# EAGLE design LOCO-Univ-Control-Adapter (EAGLE 9.7.0)

## Sheet 1 of 2
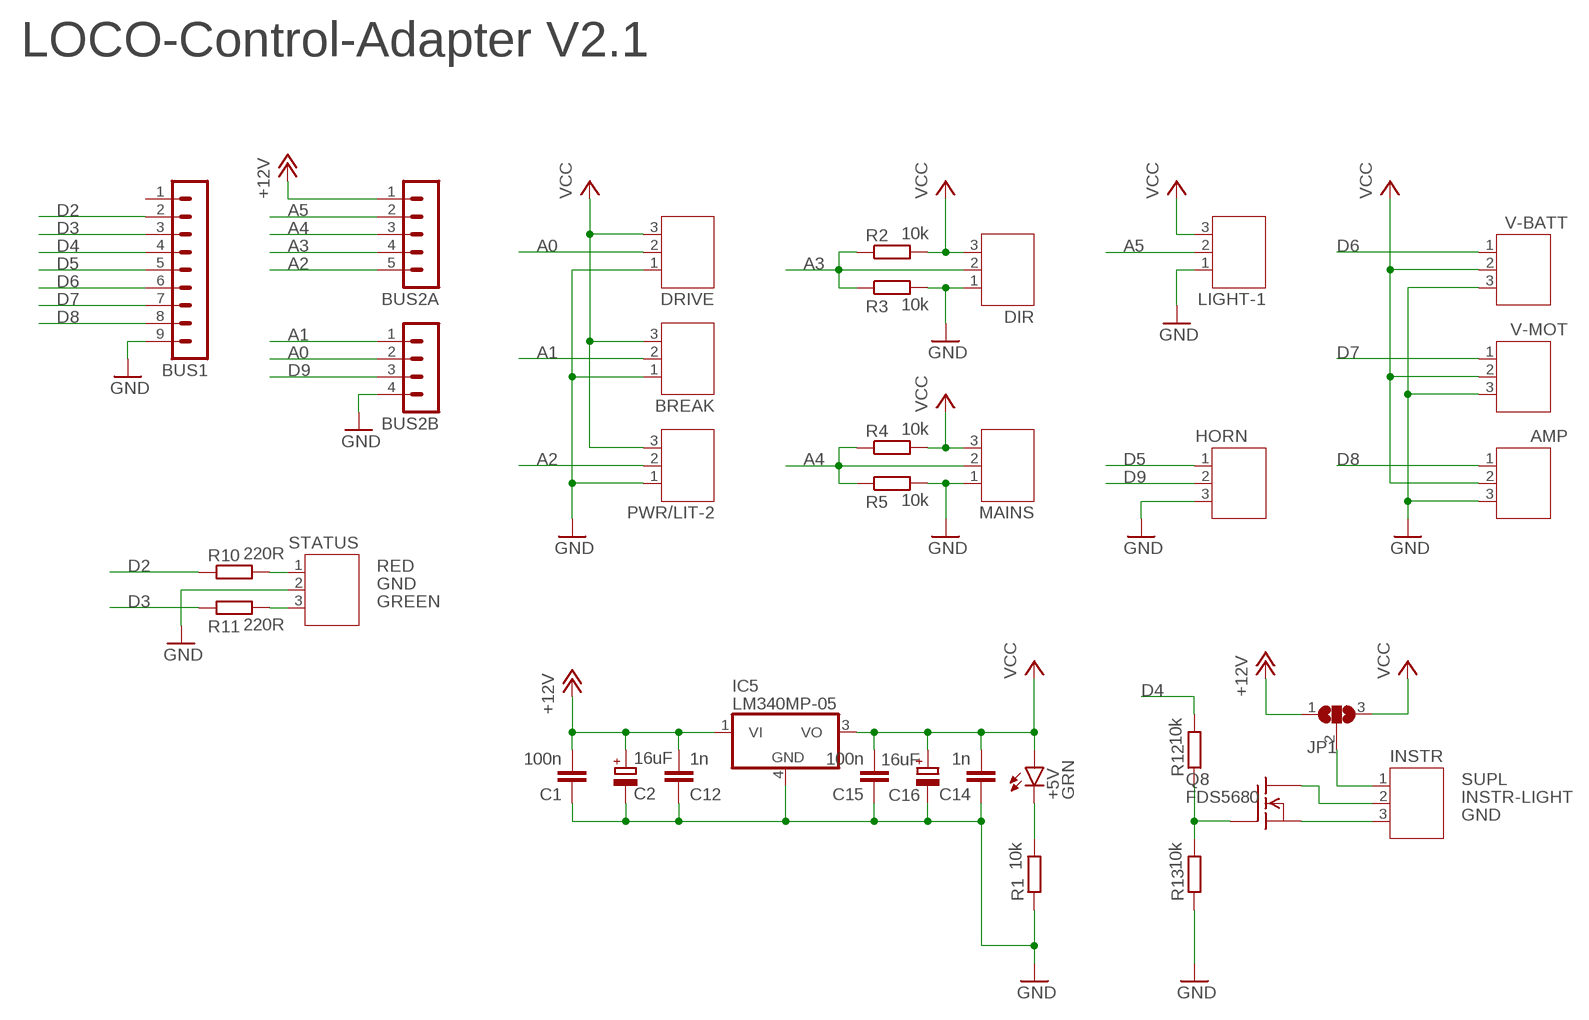
[diagram p0: schematic, sheet 1]

### Parts
+5V  GRN  LEDCHIP-LED0603  [CHIP-LED0603]
AMP  JST-PH3  [JST-PH3]
BREAK  JST-PH3  [JST-PH3]
BUS1  MA09-1  [MA09-1]
BUS2A  MA05-1  [MA05-1]
BUS2B  MA04-1  [MA04-1]
C1  100n  C-EUC0402K  [C0402K]
C2  16uF  CPOL-EUA/3216-18W  [A/3216-18W]
C12  1n  C-EUC0402K  [C0402K]
C14  1n  C-EUC0402K  [C0402K]
C15  100n  C-EUC0402K  [C0402K]
C16  16uF  CPOL-EUA/3216-18W  [A/3216-18W]
DIR  JST-PH3  [JST-PH3]
DRIVE  JST-PH3  [JST-PH3]
HORN  JST-PH3  [JST-PH3]
IC5  LM340MP-05  [SOT223]
INSTR  JST-PH3  [JST-PH3]
JP1  SJ2W  [SJ_2]
LIGHT-1  JST-PH3  [JST-PH3]
MAINS  JST-PH3  [JST-PH3]
PWR/LIT-2  JST-PH3  [JST-PH3]
Q8  FDS5680  [SO-8]
R1  10k  R-EU_R0603  [R0603]
R2  10k  R-EU_R0805  [R0805]
R3  10k  R-EU_R0805  [R0805]
R4  10k  R-EU_R0805  [R0805]
R5  10k  R-EU_R0805  [R0805]
R10  220R  R-EU_R0805  [R0805]
R11  220R  R-EU_R0805  [R0805]
R12  10k  R-EU_R0603  [R0603]
R13  10k  R-EU_R0603  [R0603]
STATUS  JST-PH3  [JST-PH3]
V-BATT  JST-PH3  [JST-PH3]
V-MOT  JST-PH3  [JST-PH3]

### Nets
+12V: BUS2A.1 C1.2 C2.+ C12.2 IC5.1(VI) JP1.1
A0: BUS2B.2 DRIVE.2
A1: BREAK.2 BUS2B.1
A2: BUS2A.5 PWR/LIT-2.2
A3: BUS2A.4 DIR.2 R2.1 R3.1
A4: BUS2A.3 MAINS.2 R4.1 R5.1
A5: BUS2A.2 LIGHT-1.2
D2: BUS1.2 R10.1
D3: BUS1.3 R11.1
D4: BUS1.4 R12.2
D5: BUS1.5 HORN.1
D6: BUS1.6 V-BATT.1
D7: BUS1.7 V-MOT.1
D8: AMP.1 BUS1.8
D9: BUS2B.3 HORN.2
GND: AMP.3 BREAK.1 BUS1.9 BUS2B.4 C1.1 C2.- C12.1 C14.1 C15.1 C16.- DIR.1 DRIVE.1 HORN.3 IC5.4(GND) INSTR.3 LIGHT-1.1 MAINS.1 PWR/LIT-2.1 Q8.1(S) Q8.2(S) Q8.3(S) R1.1 R3.2 R5.2 R13.1 STATUS.2 V-BATT.3 V-MOT.3
GREEN: R11.2 STATUS.3
INSTR-LIGHT: INSTR.2 Q8.5(D) Q8.6(D) Q8.7(D) Q8.8(D)
N$8: Q8.4(G) R12.1 R13.2
N$12: +5V.C R1.2
RED: R10.2 STATUS.1
SUPL: INSTR.1 JP1.2
VCC: +5V.A AMP.2 BREAK.3 C14.2 C15.2 C16.+ DIR.3 DRIVE.3 IC5.3(VO) JP1.3 LIGHT-1.3 MAINS.3 PWR/LIT-2.3 R2.2 R4.2 V-BATT.2 V-MOT.2
Unconnected: BUS1.1

### Notes on the sheet
- LOCO-Control-Adapter V2.1

## Sheet 2 of 2

## Library data of the parts
+5V = led:LED: LED OSRAM: - CHIPLED LG R971, LG N971, LY N971, LG Q971, LY Q971, LO R971, LY R971 LH N974, LH R974 LS Q976, LO Q976, LY Q976 LO Q996 - Hyper CHIPLED LW Q18S LB Q993, LB Q99A, LB R99A - SideLED LS A670, LO A670, LY A670, LG A670, LP A670 LB A673, LV A673, LT A673, LW A673 LH A674 LY A675 LS A676, LA A676, LO A676, LY A676, LW A676 LS A679, LY A679, LG A679 - Hyper Micro SIDELED® LS Y876, LA Y876, LO Y876, LY Y876 LT Y87S - SmartLED LW L88C, LW L88S LB L89C, LB L89S, LG L890 LS L89K, LO L89K, LY L89K LS L896, LA L896, LO L896, LY L896 - TOPLED LS T670, LO T670, LY T670, LG T670, LP T670 LSG T670, LSP T670, LSY T670, LOP T670, LYG T670 LG T671, LOG T671, LSG T671 LB T673, LV T673, LT T673, LW T673 LH T674 LS T676, LA T676, LO T676, LY T676, LB T676, LH T676, LSB T676, LW T676 LB T67C, LV T67C, LT T67C, LS T67K, LO T67K, LY T67K, LW E67C LS E67B, LA E67B, LO E67B, LY E67B, LB E67C, LV E67C, LT E67C LW T67C LS T679, LY T679, LG T679 LS T770, LO T770, LY T770, LG T770, LP T770 LB T773, LV T773, LT T773, LW T773 LH T774 LS E675, LA E675, LY E675, LS T675 LS T776, LA T776, LO T776, LY T776, LB T776 LHGB T686 LT T68C, LB T68C - Hyper Mini TOPLED® LB M676 - Mini TOPLED Santana® LG M470 LS M47K, LO M47K, LY M47K Source: http://www.osram.convergy.de LUXEON: - LUMILED® LXK2-PW12-R00, LXK2-PW12-S00, LXK2-PW14-U00, LXK2-PW14-V00 LXK2-PM12-R00, LXK2-PM12-S00, LXK2-PM14-U00 LXK2-PE12-Q00, LXK2-PE12-R00, LXK2-PE12-S00, LXK2-PE14-T00, LXK2-PE14-U00 LXK2-PB12-K00, LXK2-PB12-L00, LXK2-PB12-M00, LXK2-PB14-N00, LXK2-PB14-P00, LXK2-PB14-Q00 LXK2-PR12-L00, LXK2-PR12-M00, LXK2-PR14-Q00, LXK2-PR14-R00 LXK2-PD12-Q00, LXK2-PD12-R00, LXK2-PD12-S00 LXK2-PH12-R00, LXK2-PH12-S00 LXK2-PL12-P00, LXK2-PL12-Q00, LXK2-PL12-R00 Source: www.luxeon.com KINGBRIGHT: KA-3528ASYC Source: www.kingbright.com
AMP BREAK DIR DRIVE HORN INSTR LIGHT-1 MAINS PWR/LIT-2 STATUS V-BATT V-MOT = jst-ph:JST-PH3
BUS1 = con-lstb:MA09-1: PIN HEADER; OC_FARNELL: unknown; OC_NEWARK: unknown
BUS2A = con-lstb:MA05-1: PIN HEADER; OC_FARNELL: unknown; OC_NEWARK: unknown
BUS2B = con-lstb:MA04-1: PIN HEADER; OC_FARNELL: unknown; OC_NEWARK: unknown
C1 C12 C14 C15 = rcl:C-EU: CAPACITOR, European symbol; SPICEPREFIX: C
C2 C16 = rcl:CPOL-EU: POLARIZED CAPACITOR, European symbol; SPICEPREFIX: C
IC5 = linear:LM340?-*: Positive VOLTAGE REGULATOR Source: http://cache.national.com/ds/LM/LM340.pdf
JP1 = jumper:SJ2W: SMD solder JUMPER
Q8 = transistor-fet:FDS5680: 60V N-Channel PowerTrench TM MOSFET FAIRCHILD FDS5680.pdf
R1-R5 R10-R13 = rcl:R-EU_: RESISTOR, European symbol; SPICEPREFIX: R

## Board
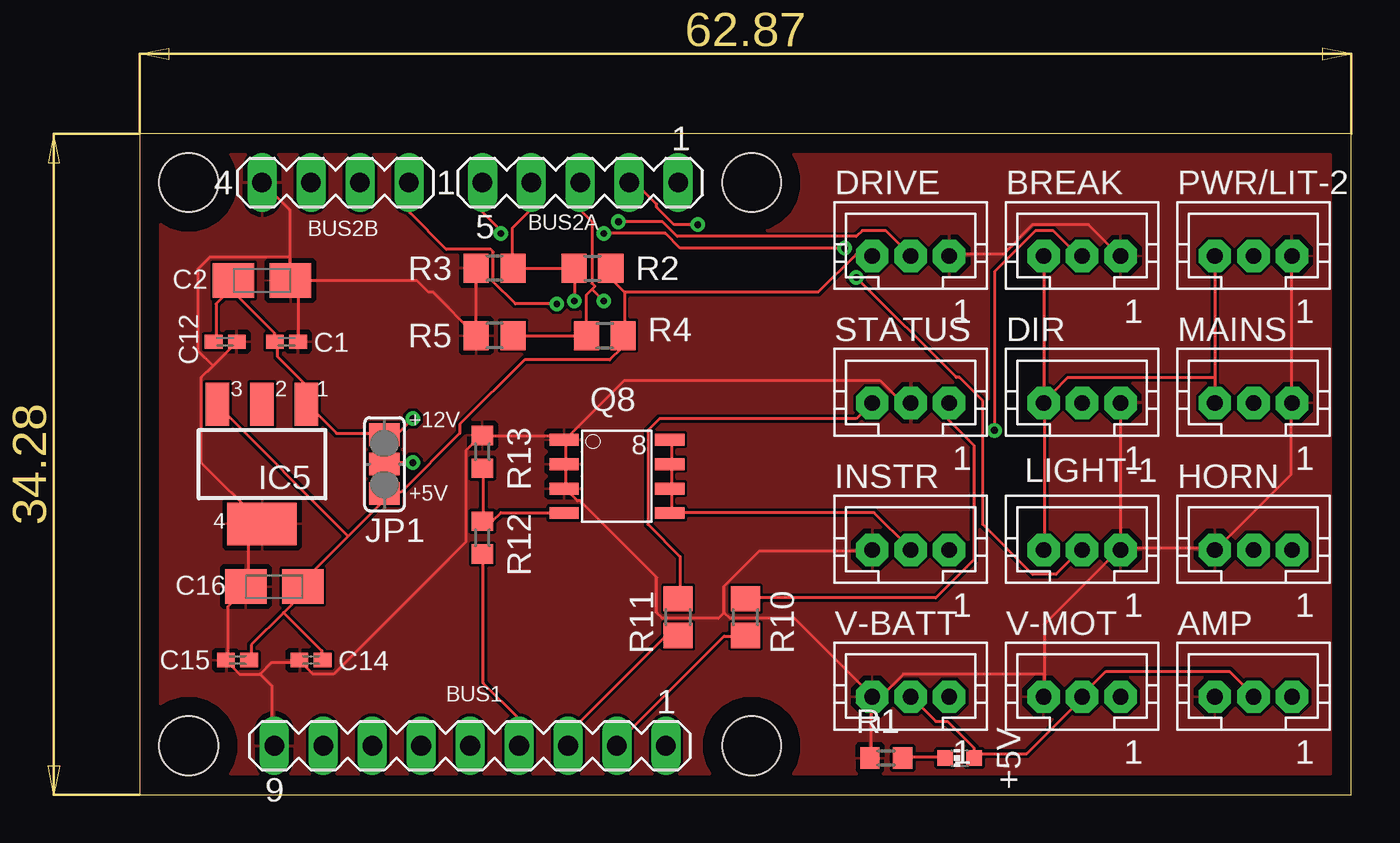
[diagram p1: board, top side]
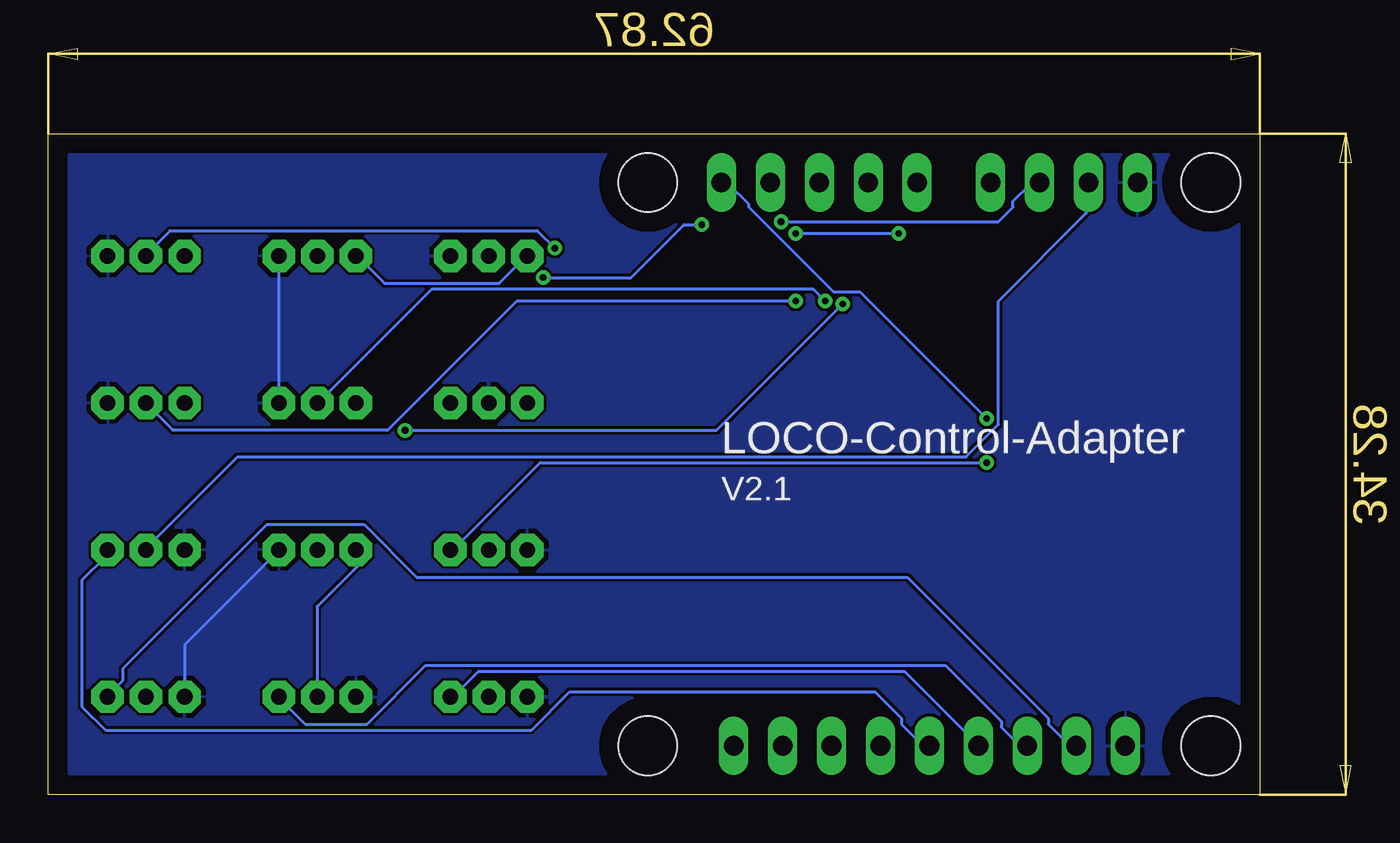
[diagram p2: board, bottom side, seen from below]

Size 62.87 x 34.29 mm. Coordinates in mm from the lower left corner, seen from the top.
Outline: 0,0 62.87,0 62.87,34.29 0,34.29 0,0
Copper layers (1*16): Top / Bottom
Stack-up Default Layer Stack: Top User Defined 0.035mm / Dielectric-1 User Defined 1.5mm / Bottom User Defined 0.035mm
Design rules "default": minimum track width 6mil, minimum drill 0.35mm, track to track 6mil, track to pad 6mil, pad to pad 6mil, via to via 6mil, smd to smd 6mil, copper to edge 40mil, drill to drill 6mil, minimum pad ring 10mil, minimum via ring 8mil, stop-mask expansion 4mil, vias tented up to drill 0mil, thermal gap 10mil
Holes 3.05 mm at 2.54,2.54 2.54,31.75 31.75,2.54 31.75,31.75

### Footprints (pad centres in the part's own frame; a part is rotated, then mirrored left to right if it is on the bottom)
CHIP-LED0603 = smd 0.8 x 0.8: A 0,-0.75; C 0,0.75
JST-PH3 = drill 0.813 pad 1.676 octagon: 1 2,0; 2 0,0; 3 -2,0
MA09-1 = drill 1.016 long: 1 -10.16,0; 2 -7.62,0; 3 -5.08,0; 4 -2.54,0; 5 0,0; 6 2.54,0; 7 5.08,0; 8 7.62,0; 9 10.16,0
MA05-1 = drill 1.016 long: 1 -5.08,0; 2 -2.54,0; 3 0,0; 4 2.54,0; 5 5.08,0
MA04-1 = drill 1.016 long: 1 -3.81,0; 2 -1.27,0; 3 1.27,0; 4 3.81,0
C0402K = smd 0.925 x 0.74: 1 -0.6,0; 2 0.6,0
A/3216-18W = smd 2.15 x 1.8: + 1.475,0; - -1.475,0
SOT223 = smd 1.219 x 2.235: 1 -2.311,-3.099; 2 0,-3.099; 3 2.311,-3.099 | smd 3.6 x 2.2: 4 0,3.099
SJ_2 = smd 1.168 x 1.6: 1 -1.524,0; 2 0,0; 3 1.524,0
SO-8 = smd 1.524 x 0.61: 1 -2.743,1.905; 2 -2.743,0.635; 3 -2.743,-0.635; 4 -2.743,-1.905; 5 2.743,-1.905; 6 2.743,-0.635; 7 2.743,0.635; 8 2.743,1.905
R0603 = smd 1 x 1.1: 1 -0.85,0; 2 0.85,0
R0805 = smd 1.3 x 1.5: 1 -0.95,0; 2 0.95,0

### Placement (x,y rotation side)
+5V  42.55,1.91 90 top
AMP  57.78,5.08 0 top
BREAK  48.9,27.94 0 top
BUS1  17.14,2.54 180 top
BUS2A  22.86,31.75 180 top
BUS2B  10.16,31.75 180 top
C1  7.62,23.5 180 top
C2  6.35,26.67 180 top
C12  4.45,23.5 180 top
C14  8.89,6.99 0 top
C15  5.08,6.99 0 top
C16  6.99,10.79 0 top
DIR  48.9,20.32 0 top
DRIVE  40.01,27.94 0 top
HORN  57.78,12.7 0 top
IC5  6.35,17.14 180 top
INSTR  40.01,12.7 0 top
JP1  12.7,17.14 270 top
LIGHT-1  48.9,12.7 0 top
MAINS  57.78,20.32 0 top
PWR/LIT-2  57.78,27.94 0 top
Q8  24.77,16.51 0 top
R1  38.73,1.91 0 top
R2  23.5,27.3 0 top
R3  18.41,27.3 180 top
R4  24.13,23.81 0 top
R5  18.41,23.81 180 top
R10  31.43,9.21 90 top
R11  27.94,9.21 90 top
R12  17.78,13.34 270 top
R13  17.78,17.78 270 top
STATUS  40.01,20.32 0 top
V-BATT  40.01,5.08 0 top
V-MOT  48.9,5.08 0 top

### Tracks (layer width: path | path; a pad name or v marks a point on that pad's centre or on a via)
+12V  (via drill 0.35)
  Top 0.152: 4.72,26.21 3.96,25.45 3.96,23.62 C12.2 | 4.72,26.21 4.72,26.67 C2.+ 4.72,26.21 | 4.72,26.21 7.01,23.93 7.01,23.62 C1.2 7.16,23.47 7.16,22.71 8.53,21.34 8.53,20.27 IC5.1 8.69,20.27 10.21,18.75 12.65,18.75 JP1.1 12.8,18.75 13.41,18.75 v14.17,19.51
  Bottom 0.152: v14.17,19.51 20.73,26.06 22.1,26.06 26.52,30.48 26.52,30.63 27.58,31.7 27.89,31.7 BUS2A.1
A0  (via drill 0.35)
  Top 0.152: v24.84,29.72 27.13,29.72 27.89,28.96 37.19,28.96 37.49,29.26 38.71,29.26 39.93,28.04 DRIVE.2
  Bottom 0.152: v24.84,29.72 13.56,29.72 12.8,30.48 12.8,30.79 11.89,31.7 11.43,31.7 BUS2B.2
A1  (via drill 0.35)
  Top 0.152: v44.35,18.9 44.35,27.13 46.48,29.26 47.4,29.26 48.77,27.89 BREAK.2 | BUS2B.1 14.02,31.7 14.02,30.18 15.91,28.28 18.21,28.28 18.34,28.15 18.34,26.6 19.5,25.45 v21.64,25.45
  Bottom 0.152: v21.64,25.45 28.19,18.9 v44.35,18.9
A2  (via drill 0.35)
  Top 0.152: v18.75,29.11 18.75,29.26 17.83,30.18 17.83,31.7 BUS2A.5 | v24.08,29.11 27.28,29.11 28.04,28.35 v36.58,28.35
  Bottom 0.152: v24.08,29.11 v18.75,29.11 | v36.58,28.35 37.49,29.26 56.54,29.26 57.76,28.04 PWR/LIT-2.2
A3  (via drill 0.35)
  Top 0.152: BUS2A.4 20.27,31.7 20.27,30.33 19.36,29.41 19.36,27.43 R3.1 19.51,27.28 22.4,27.28 R2.1 22.55,27.28 v22.55,25.6
  Bottom 0.152: v22.55,25.6 23.16,26.21 42.98,26.21 48.77,20.42 DIR.2
A4  (via drill 0.35)
  Top 0.152: R5.1 19.51,23.77 23.16,23.77 R4.1 23.16,23.93 23.16,25.91 23.47,26.21 | 23.47,26.21 23.62,26.36 23.47,26.52 23.47,29.72 22.86,30.33 BUS2A.3 | 23.47,26.21 v24.08,25.6
  Bottom 0.152: v24.08,25.6 38.56,25.6 45.26,18.9 56.39,18.9 57.76,20.27 MAINS.2
A5  (via drill 0.35)
  Top 0.152: v28.96,29.57 27.74,29.57 26.82,30.48 26.82,30.63 25.76,31.7 25.45,31.7 BUS2A.2 | v37.19,26.82 42.37,21.64 42.52,21.64 43.74,20.42 43.74,14.02 46.33,11.43 47.55,11.43 48.77,12.65 LIGHT-1.2
  Bottom 0.152: v28.96,29.57 29.87,29.57 32.61,26.82 v37.19,26.82
D2
  Top 0.152: R10.1 31.39,8.23 30.33,8.23 24.69,2.59 BUS1.2
D3
  Top 0.152: R11.1 27.89,8.23 27.28,8.23 22.25,3.2 22.25,2.59 BUS1.3
D4
  Top 0.152: R12.2 17.83,12.34 17.83,5.79 19.66,3.96 19.66,2.59 BUS1.4
D5
  Bottom 0.152: BUS1.5 17.22,2.59 17.53,2.59 18.59,3.66 18.59,3.96 19.96,5.33 35.81,5.33 37.8,3.35 59.89,3.35 61.11,4.57 61.11,11.12 59.89,12.34 59.89,12.65 HORN.1
D6
  Bottom 0.152: BUS1.6 14.63,2.59 18.44,6.4 40.54,6.4 41.91,5.03 V-BATT.1
D7
  Bottom 0.152: BUS1.7 12.19,2.59 12.5,2.59 13.41,3.5 13.41,3.81 16.31,6.71 43.28,6.71 46.33,3.66 49.53,3.66 50.9,5.03 V-MOT.1
D8
  Bottom 0.152: BUS1.8 9.6,2.59 9.91,2.59 10.97,3.66 10.97,3.96 18.29,11.28 43.74,11.28 46.48,14.02 51.51,14.02 58.98,6.55 58.98,5.94 59.74,5.18 AMP.1
D9
  Bottom 0.152: BUS2B.3 8.99,31.7 8.99,30.18 13.56,25.6 13.56,19.2 15.24,17.53 53.03,17.53 57.76,12.8 HORN.2
GND
  Top 0.152: 8.23,26.67 14.38,26.67 14.99,26.06 15.22,26.06 R5.2 R3.2 | 6.25,6.25 6.86,6.86 8.23,6.86 C14.1 8.38,6.86 8.99,6.25 10.06,6.25 16.92,13.11 16.92,17.83 17.68,18.59 R13.1 17.83,18.59 21.79,18.59 21.95,18.44 Q8.1 | 6.25,6.25 5.18,6.25 4.57,6.86 C15.1 4.57,7.01 4.57,9.75 5.49,10.67 C16.- 5.64,10.82 5.64,13.41 6.25,14.02 IC5.4 6.25,14.17 3.2,17.22 3.2,21.64 3.81,22.25 | 6.25,6.25 6.86,5.64 6.86,2.59 BUS1.9 | 8.23,26.67 8.23,23.62 C1.1 | 8.23,26.67 C2.- 7.77,26.67 7.77,27.89 | 7.77,27.89 7.77,30.33 BUS2B.4 | 3.81,22.25 5.03,23.47 C12.1 | 7.77,27.89 3.66,27.89 3.05,27.28 3.05,23.01 3.81,22.25 | Q8.1 22.1,18.29 22.1,17.22 Q8.2 22.1,17.07 22.1,16 Q8.3 22.1,15.85 22.71,15.24 22.86,15.24 26.82,11.28 26.82,9.45 27.13,9.14 30.02,9.14 30.33,9.45 | STATUS.2 39.93,20.42 39.47,20.42 38.41,21.49 25.15,21.49 22.1,18.44 Q8.1 | DRIVE.1 42.06,28.04 44.81,28.04 46.33,29.57 49.23,29.57 50.75,28.04 BREAK.1 | R1.1 37.95,1.98 37.95,5.03 V-BATT.3 | 30.33,9.45 30.33,10.82 32.16,12.65 37.95,12.65 INSTR.3 | 30.33,9.45 30.63,9.14 33.98,9.14 37.95,5.18 V-BATT.3 | PWR/LIT-2.1 59.74,27.89 59.74,20.42 MAINS.1 59.74,20.27 59.74,16.61 55.93,12.8 HORN.3 55.78,12.8 50.9,12.8 | 46.94,6.25 46.94,8.84 50.75,12.65 LIGHT-1.1 50.9,12.8 | 46.94,6.25 46.94,5.18 V-MOT.3 | 46.94,6.25 39.62,6.25 38.56,5.18 38.1,5.18 V-BATT.3 | 50.9,12.8 50.9,20.27 DIR.1
  Bottom 0.152: DIR.1 50.9,20.42 50.9,27.89 BREAK.1 | AMP.3 55.78,5.18 55.78,7.77 50.9,12.65 LIGHT-1.1
  pour Top: 0,34.29 62.87,34.29 62.87,0 0,0
  pour Bottom: 0,34.29 62.87,34.29 62.87,0 0,0
GREEN
  Top 0.152: R11.2 28.04,10.21 28.04,12.34 26.36,14.02 26.36,18.9 26.98,19.51 37.19,19.51 37.95,20.27 STATUS.3
INSTR-LIGHT
  Top 0.152: 27.58,14.63 27.58,15.85 Q8.6 27.58,16 27.58,17.07 Q8.7 27.58,17.22 27.58,18.29 Q8.8 | 27.58,14.63 38.1,14.63 39.93,12.8 INSTR.2 | 27.58,14.63 Q8.5
N$8
  Top 0.152: R13.2 17.83,16.92 17.83,14.33 R12.1 17.83,14.17 18.29,14.17 18.75,14.63 21.95,14.63 Q8.4
N$12
  Top 0.152: +5V.C 41.76,1.98 39.62,1.98 R1.2
RED
  Top 0.152: R10.2 31.55,10.21 41.3,10.21 43.28,12.19 43.28,18.14 41.91,19.51 41.91,20.27 STATUS.1
SUPL  (via drill 0.35)
  Top 0.152: v14.17,17.22 12.8,17.22 JP1.2
  Bottom 0.152: v14.17,17.22 37.34,17.22 41.91,12.65 INSTR.1
VCC
  Top 0.152: 43.28,2.13 43.28,2.44 41.91,3.81 41.3,3.81 40.08,5.03 V-BATT.2 | 43.28,2.13 43.28,1.98 +5V.A 43.28,2.13 | 43.28,2.13 46.02,2.13 48.46,4.57 48.46,4.72 48.77,5.03 V-MOT.2 48.92,5.18 50.14,6.4 56.54,6.4 57.76,5.18 AMP.2 | 7.47,9.45 8.38,10.36 8.38,10.67 C16.+ 8.53,10.82 8.53,11.12 10.82,13.41 | 7.47,9.45 5.79,7.77 5.79,7.01 C15.2 | 7.47,9.45 9.45,7.47 9.45,7.01 C14.2 | 10.82,13.41 12.65,15.24 12.65,15.54 JP1.3 12.8,15.7 13.56,15.7 16.61,18.75 16.61,19.2 19.96,22.55 24.38,22.55 24.99,23.16 24.99,23.77 R4.2 25.15,23.93 25.15,26.06 | 10.82,13.41 4.12,20.12 IC5.3 | 25.15,26.06 24.54,26.67 24.54,27.28 R2.2 | 25.15,26.06 35.2,26.06 37.19,28.04 37.95,28.04 DRIVE.3 | 55.78,21.64 55.78,27.89 PWR/LIT-2.3 | 55.78,21.64 55.78,20.42 MAINS.3 | LIGHT-1.3 46.94,12.8 46.94,20.27 DIR.3 | 46.94,20.88 46.94,20.42 DIR.3 | 46.94,20.88 46.94,27.89 BREAK.3 | 55.78,21.64 48.16,21.64 47.4,20.88 46.94,20.88 | 46.94,20.88 DIR.3
  Bottom 0.152: DRIVE.3 38.1,27.89 39.47,26.52 45.41,26.52 46.79,27.89 BREAK.3 | V-MOT.2 48.92,5.18 48.92,9.75 46.79,11.89 46.79,12.65 LIGHT-1.3

### Text on the board
tNames: +12V | +5V
bNames: LOCO-Control-Adapter | V2.1